# Altium schematic sheet mcu2.SchDoc
size A4
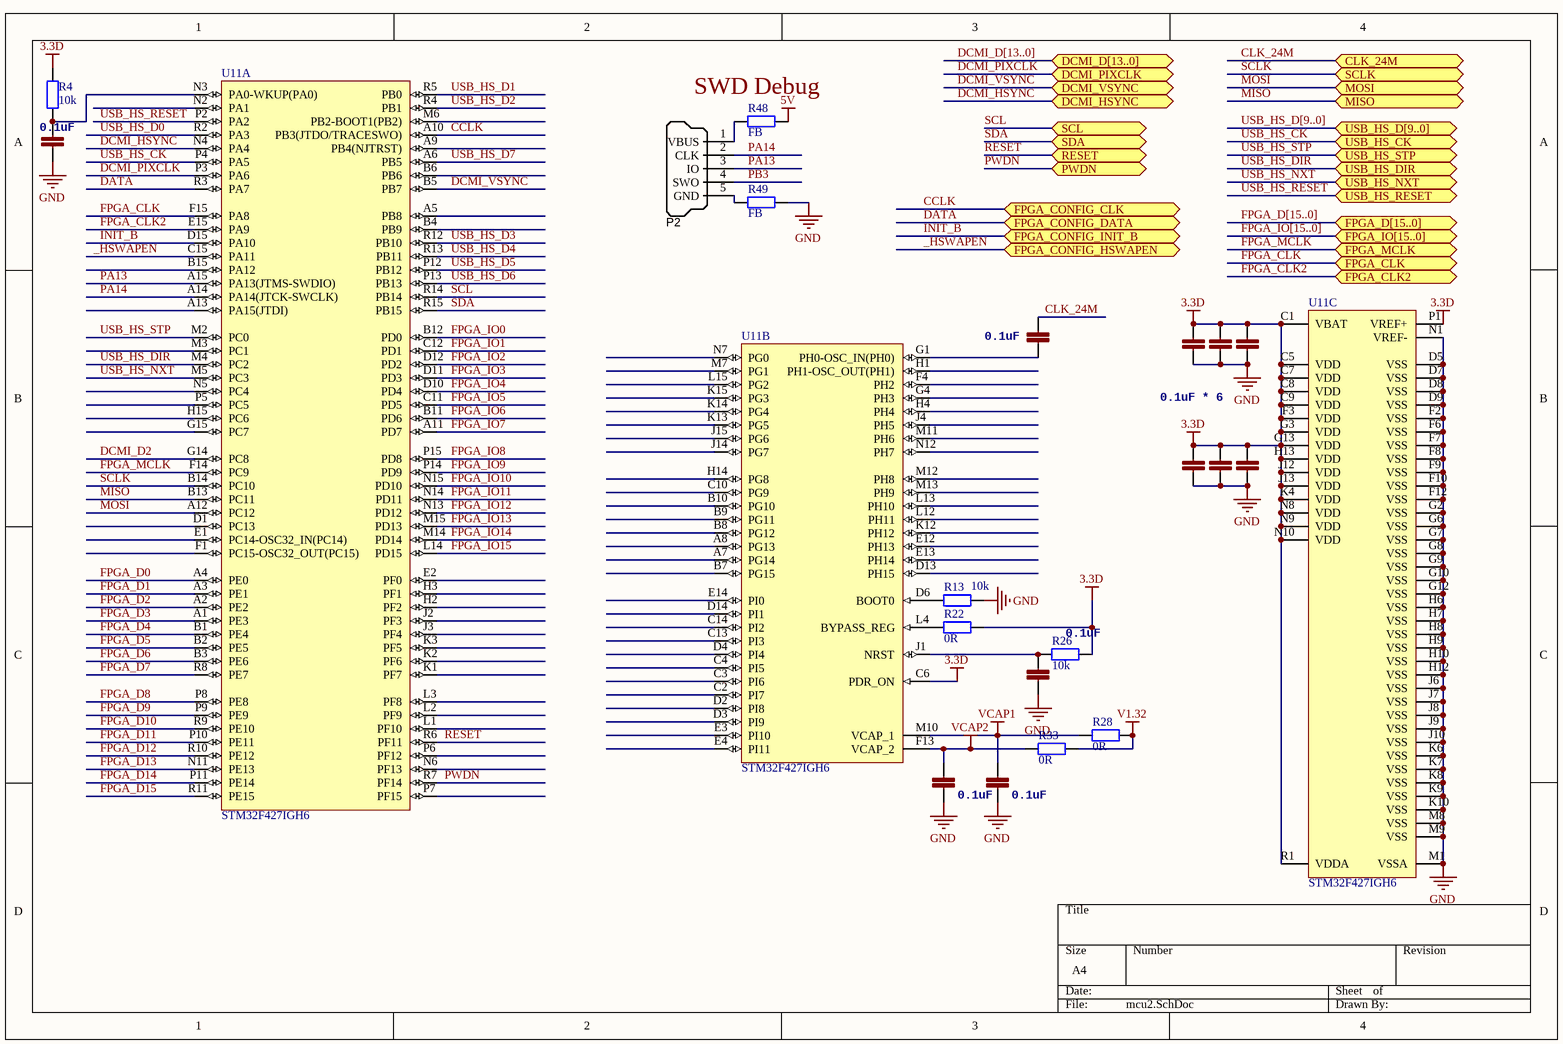
[diagram p0: mcu2.SchDoc]

## Parts
C4  0.1uF * 6  [0402]  (value not drawn)
C5  0.1uF  [0402]  (value not drawn)
C6  0.1uF  [0402]  (value not drawn)
C12  0.1uF  [0402]
C13  0.1uF  [0402]  (value not drawn)
C14  0.1uF  [0402]  (value not drawn)
C15  0.1uF  [0402]
C35  0.1uF * 6  [0402]
C36  0.1uF  [0402]
C37  0.1uF  [0402]
C38  0.1uF  [0402]
P2  SWD_MicroUSB  [MICRO-YZX]  (value not drawn)
R4  10k  [0402]
R13  10k  [0402]
R22  0R  [0402]
R26  10k  [0402]
R28  0R  [0402]
R33  0R  [0402]
R48  FB  [0603]
R49  FB  [0603]
U11  STM32F427IGH6  [STM-UFBGA176+25_M]  (parts A,B,C of 3)

## Ports
CLK_24M, DCMI_D[13..0], DCMI_HSYNC, DCMI_PIXCLK, DCMI_VSYNC, FPGA_CLK, FPGA_CLK2, FPGA_CONFIG_CLK, FPGA_CONFIG_DATA, FPGA_CONFIG_HSWAPEN, FPGA_CONFIG_INIT_B, FPGA_D[15..0], FPGA_IO[15..0], FPGA_MCLK, MISO, MOSI, PWDN, RESET, SCL, SCLK, SDA, USB_HS_CK, USB_HS_D[9..0], USB_HS_DIR, USB_HS_NXT, USB_HS_RESET, USB_HS_STP

## Nets
3.3D: C4.2 C5.2 C6.2 C13.2 C14.2 C35.2 R4.1 R22.1 R26.2 U11.C1(VBAT) U11.C5(VDD) U11.C6(PDR_ON) U11.C7(VDD) U11.C8(VDD) U11.C9(VDD) U11.F3(VDD) U11.G3(VDD) U11.G13(VDD) U11.H13(VDD) U11.J12(VDD) U11.J13(VDD) U11.K4(VDD) U11.N8(VDD) U11.N9(VDD) U11.N10(VDD) U11.P1(VREF+) U11.R1(VDDA)
5V: R48.1
GND: C4.1 C5.1 C6.1 C12.1 C13.1 C14.1 C35.1 C36.1 C37.1 C38.1 R13.1 R49.1 U11.D5(VSS) U11.D7(VSS) U11.D8(VSS) U11.D9(VSS) U11.F2(VSS) U11.F6(VSS) U11.F7(VSS) U11.F8(VSS) U11.F9(VSS) U11.F10(VSS) U11.F12(VSS) U11.G2(VSS) U11.G6(VSS) U11.G7(VSS) U11.G8(VSS) U11.G9(VSS) U11.G10(VSS) U11.G12(VSS) U11.H6(VSS) U11.H7(VSS) U11.H8(VSS) U11.H9(VSS) U11.H10(VSS) U11.H12(VSS) U11.J6(VSS) U11.J7(VSS) U11.J8(VSS) U11.J9(VSS) U11.J10(VSS) U11.K6(VSS) U11.K7(VSS) U11.K8(VSS) U11.K9(VSS) U11.K10(VSS) U11.M1(VSSA) U11.M8(VSS) U11.M9(VSS) U11.N1(VREF-)
V1.32: R28.2 R33.2
VCAP1: C38.2 R28.1 U11.M10(VCAP_1)
VCAP2: C37.2 R33.1 U11.F13(VCAP_2)
_HSWAPEN: U11.C15(PA11) ; port FPGA_CONFIG_HSWAPEN
CCLK: U11.A10(PB3(JTDO/TRACESWO)) ; port FPGA_CONFIG_CLK
CLK_24M: C15.2 ; port CLK_24M
DATA: U11.R3(PA7) ; port FPGA_CONFIG_DATA
DCMI_D2: U11.G14(PC8)
DCMI_HSYNC: U11.N4(PA4) ; port DCMI_HSYNC
DCMI_PIXCLK: U11.P3(PA6) ; port DCMI_PIXCLK
DCMI_VSYNC: U11.B5(PB7) ; port DCMI_VSYNC
FPGA_CLK: U11.F15(PA8) ; port FPGA_CLK
FPGA_CLK2: U11.E15(PA9) ; port FPGA_CLK2
FPGA_D0: U11.A4(PE0)
FPGA_D1: U11.A3(PE1)
FPGA_D2: U11.A2(PE2)
FPGA_D3: U11.A1(PE3)
FPGA_D4: U11.B1(PE4)
FPGA_D5: U11.B2(PE5)
FPGA_D6: U11.B3(PE6)
FPGA_D7: U11.R8(PE7)
FPGA_D8: U11.P8(PE8)
FPGA_D9: U11.P9(PE9)
FPGA_D10: U11.R9(PE10)
FPGA_D11: U11.P10(PE11)
FPGA_D12: U11.R10(PE12)
FPGA_D13: U11.N11(PE13)
FPGA_D14: U11.P11(PE14)
FPGA_D15: U11.R11(PE15)
FPGA_IO0: U11.B12(PD0)
FPGA_IO1: U11.C12(PD1)
FPGA_IO2: U11.D12(PD2)
FPGA_IO3: U11.D11(PD3)
FPGA_IO4: U11.D10(PD4)
FPGA_IO5: U11.C11(PD5)
FPGA_IO6: U11.B11(PD6)
FPGA_IO7: U11.A11(PD7)
FPGA_IO8: U11.P15(PD8)
FPGA_IO9: U11.P14(PD9)
FPGA_IO10: U11.N15(PD10)
FPGA_IO11: U11.N14(PD11)
FPGA_IO12: U11.N13(PD12)
FPGA_IO13: U11.M15(PD13)
FPGA_IO14: U11.M14(PD14)
FPGA_IO15: U11.L14(PD15)
FPGA_MCLK: U11.F14(PC9) ; port FPGA_MCLK
INIT_B: U11.D15(PA10) ; port FPGA_CONFIG_INIT_B
MISO: U11.B13(PC11) ; port MISO
MOSI: U11.A12(PC12) ; port MOSI
PA13: P2.3(IO) U11.A15(PA13(JTMS-SWDIO))
PA14: P2.2(CLK) U11.A14(PA14(JTCK-SWCLK))
PB3: P2.4(SWO)
PWDN: U11.R7(PF14) ; port PWDN
RESET: U11.R6(PF11) ; port RESET
SCL: U11.R14(PB14) ; port SCL
SCLK: U11.B14(PC10) ; port SCLK
SDA: U11.R15(PB15) ; port SDA
USB_HS_CK: U11.P4(PA5) ; port USB_HS_CK
USB_HS_D0: U11.R2(PA3)
USB_HS_D1: U11.R5(PB0)
USB_HS_D2: U11.R4(PB1)
USB_HS_D3: U11.R12(PB10)
USB_HS_D4: U11.R13(PB11)
USB_HS_D5: U11.P12(PB12)
USB_HS_D6: U11.P13(PB13)
USB_HS_D7: U11.A6(PB5)
USB_HS_DIR: U11.M4(PC2) ; port USB_HS_DIR
USB_HS_NXT: U11.M5(PC3) ; port USB_HS_NXT
USB_HS_RESET: U11.P2(PA2) ; port USB_HS_RESET
USB_HS_STP: U11.M2(PC0) ; port USB_HS_STP
NetC12_2: C12.2 R4.2 U11.N3(PA0-WKUP(PA0))
NetC15_1: C15.1 U11.G1(PH0-OSC_IN(PH0))
NetC36_2: C36.2 R26.1 U11.J1(NRST)
NetP2_1: P2.1(VBUS) R48.2
NetP2_5: P2.5(GND) R49.2
NetR13_2: R13.2 U11.D6(BOOT0)
NetR22_2: R22.2 U11.L4(BYPASS_REG)

Not connected (* = marked no-connect by the designer): U11 A5(PB8) A7(PG14) A8(PG13) A9(PB4(NJTRST)) A13(PA15(JTDI)) B4(PB9) B6(PB6) B7(PG15) B8(PG12) B9(PG11) B10(PG10) B15(PA12) C2(PI7) C3(PI6) C4(PI5) C10(PG9) C13(PI3) C14(PI2) D1(PC13) D2(PI8) D3(PI9) D4(PI4) D13(PH15) D14(PI1) E1(PC14-OSC32_IN(PC14)) E2(PF0) E3(PI10) E4(PI11) E12(PH13) E13(PH14) E14(PI0) F1(PC15-OSC32_OUT(PC15)) F4(PH2) G4(PH3) G15(PC7) H1(PH1-OSC_OUT(PH1)) H2(PF2) H3(PF1) H4(PH4) H14(PG8) H15(PC6) J2(PF3) J3(PF4) J4(PH5) J14(PG7) J15(PG6) K1(PF7) K2(PF6) K3(PF5) K12(PH12) K13(PG5) K14(PG4) K15(PG3) L1(PF10) L2(PF9) L3(PF8) L12(PH11) L13(PH10) L15(PG2) M3(PC1) M6(PB2-BOOT1(PB2)) M7(PG1) M11(PH6) M12(PH8) M13(PH9) N2(PA1) N5(PC4) N6(PF13) N7(PG0) N12(PH7) P5(PC5) P6(PF12) P7(PF15)

## Buses and harness runs
bus DCMI_D[13..0] = port DCMI_D[13..0]
bus FPGA_D[15..0] = port FPGA_D[15..0]
bus FPGA_IO[15..0] = port FPGA_IO[15..0]
bus USB_HS_D[9..0] = port USB_HS_D[9..0]

## Notes on the sheet
- (near R48) SWD Debug

## Library data of the parts
C4-C6 C12-C15 C35-C38 = CAP0402-CAP: <b>Capacitor</b> / Standard 0603 ceramic capacitor, and 0.1" leaded capacitor.; PARTNO: CC0402ZRY5V7BB104
P2 = SWD_MicroUSB: Connector SMD USB Micro Type B middle mount; Manufacturer 1: Molex Inc; SCDType: undef; Package / Case: SMD; Supplier 1: Digi-Key; Supplier Part Number 1: WM17142CT-ND
R4 R13 R22 R26 R28 R33 R48 R49 = Res2: Resistor; Value: 0Ohm; Published: 8-Jun-2000; LatestRevisionDate: 17-Jul-2002; LatestRevisionNote: Re-released for DXP Platform.; PackageReference: AXIAL-0.4; Publisher: Altium Limited; PackageDescription: Axial Device, Thru-Hole; 2 Leads; 0.4 in Pin Spacing
U11 = STM32F427IGH6: ARM Cortex-M4 32-bit MCU+FPU, 210 DMIPS, 1024 kB Flash, 256 kB Internal RAM, 140 I/Os, 176-pin UFBGA, -40 to 85 degC, Tray; Manufacturer: STMicroelectronics; D/A Converter: 2x12-bit; FLASH Size (Prog) (kB): 1024; I/Os (High Current): 140; Internal RAM Size (kB): 256; Operating Frequency(F) (Processor speed) (MHz): 168; Supply Voltage(Vcc) max (V): 3.6; Supply Voltage(Vcc) min (V): 1.8; DatasheetVersion: Rev. 1; PackageVersion: Rev. 4, 06/2013; PackageReference: UFBGA176+25; PackageDescription: 176+25-Ball Ultra Thin Fine Pitch Ball Grid Array, 10 x 10 x 0.6 mm Body, 0.65 mm Pitch; Supplier 1: Digi-Key; Supplier Part Number 1: STM32F427IGH6-ND; Supplier 2: Newark; Supplier Part Number 2: 06X3665; Supplier 3: Mouser; Supplier Part Number 3: 511-STM32F427IGH6; Core: ARM Cortex-M4; Packing: Tray; Mounting Technology: Surface Mount; PartNumber: STM32F427IGH6; ComponentLink1Description: Manufacturer URL; ComponentLink1URL: http://www.st.com/web/en/home.html; ComponentLink2Description: Datasheet; ComponentLink2URL: http://www.st.com/st-web-ui/static/active/en/resource/technical/document/datasheet/DM00071990.pdf; ComponentLink3Description: Package Specification; ComponentLink3URL: http://www.st.com/st-web-ui/static/active/en/resource/technical/document/datasheet/DM00037051.pdf